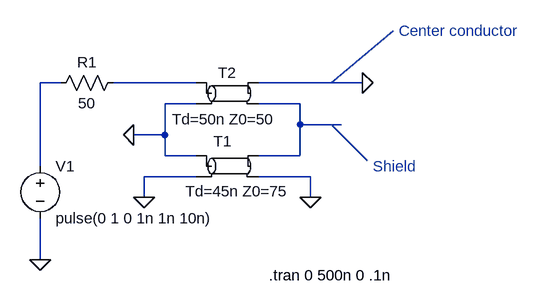
[diagram p0: schematic LinTrasm.asc]
LinTrasm.asc, the LTspice schematic file:
Version 4
SHEET 1 880 680
WIRE 16 336 16 304
WIRE 16 304 96 304
WIRE 192 304 272 304
WIRE 272 304 272 336
WIRE 256 272 192 272
WIRE 96 160 -32 160
WIRE -144 160 -144 288
WIRE -144 368 -144 432
WIRE -112 160 -144 160
WIRE 96 192 48 192
WIRE 48 192 48 240
WIRE 48 272 96 272
WIRE 192 192 256 192
WIRE 256 192 256 224
WIRE 192 160 352 160
WIRE 256 224 320 224
WIRE 256 224 256 272
WIRE 48 240 0 240
WIRE 48 240 48 272
FLAG 16 336 0
FLAG -144 432 0
FLAG 272 336 0
FLAG 352 160 0
FLAG 0 240 0
SYMBOL tline 144 288 R0
WINDOW 0 -21 -38 Left 0
WINDOW 3 -64 39 Left 0
SYMATTR InstName T1
SYMATTR Value Td=45n Z0=75
SYMBOL voltage -144 272 R0
SYMATTR InstName V1
SYMATTR Value pulse(0 1 0 1n 1n 10n)
SYMBOL res -16 144 R90
WINDOW 0 0 56 VBottom 0
WINDOW 3 32 56 VTop 0
SYMATTR InstName R1
SYMATTR Value 50
SYMBOL tline 144 176 R0
WINDOW 3 -85 40 Left 0
SYMATTR InstName T2
TEXT 208 456 Left 0 !.tran 0 500n 0 .1n
TEXT 408 80 Left 0 ;Center conductor
TEXT 368 288 Left 0 ;Shield
LINE Normal 400 80 304 160
LINE Normal 360 280 304 224

The netlist it stands for:
* LinTrasm.asc
T1 0 0 N001 0 Td=45n Z0=75
V1 N003 0 pulse(0 1 0 1n 1n 10n)
R1 N002 N003 50
T2 N002 0 0 N001 Td=50n Z0=50
.tran 0 500n 0 .1n
* Center conductor
* Shield
.backanno
.end